# EAGLE schematic decoupling (EAGLE 7.3.0)
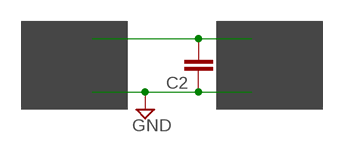
[diagram p0: schematic, sheet 1]

## Parts
C2  C5/2.5  [C5B2.5]

## Nets
GND: C2.1
N$4: C2.2

## Notes on the sheet
- Circuit A | Circuit B

## Library data of the parts
C2 = capacitor-wima:C: CAPACITOR naming: grid - package width